# Altium schematic sheet HashPower1.SchDoc: ANT_Miner_V1.3
size A4; Date: 2013/11/20; DrawnBy: Bitmain Technology; SheetNumber: 2; SheetTotal: 9
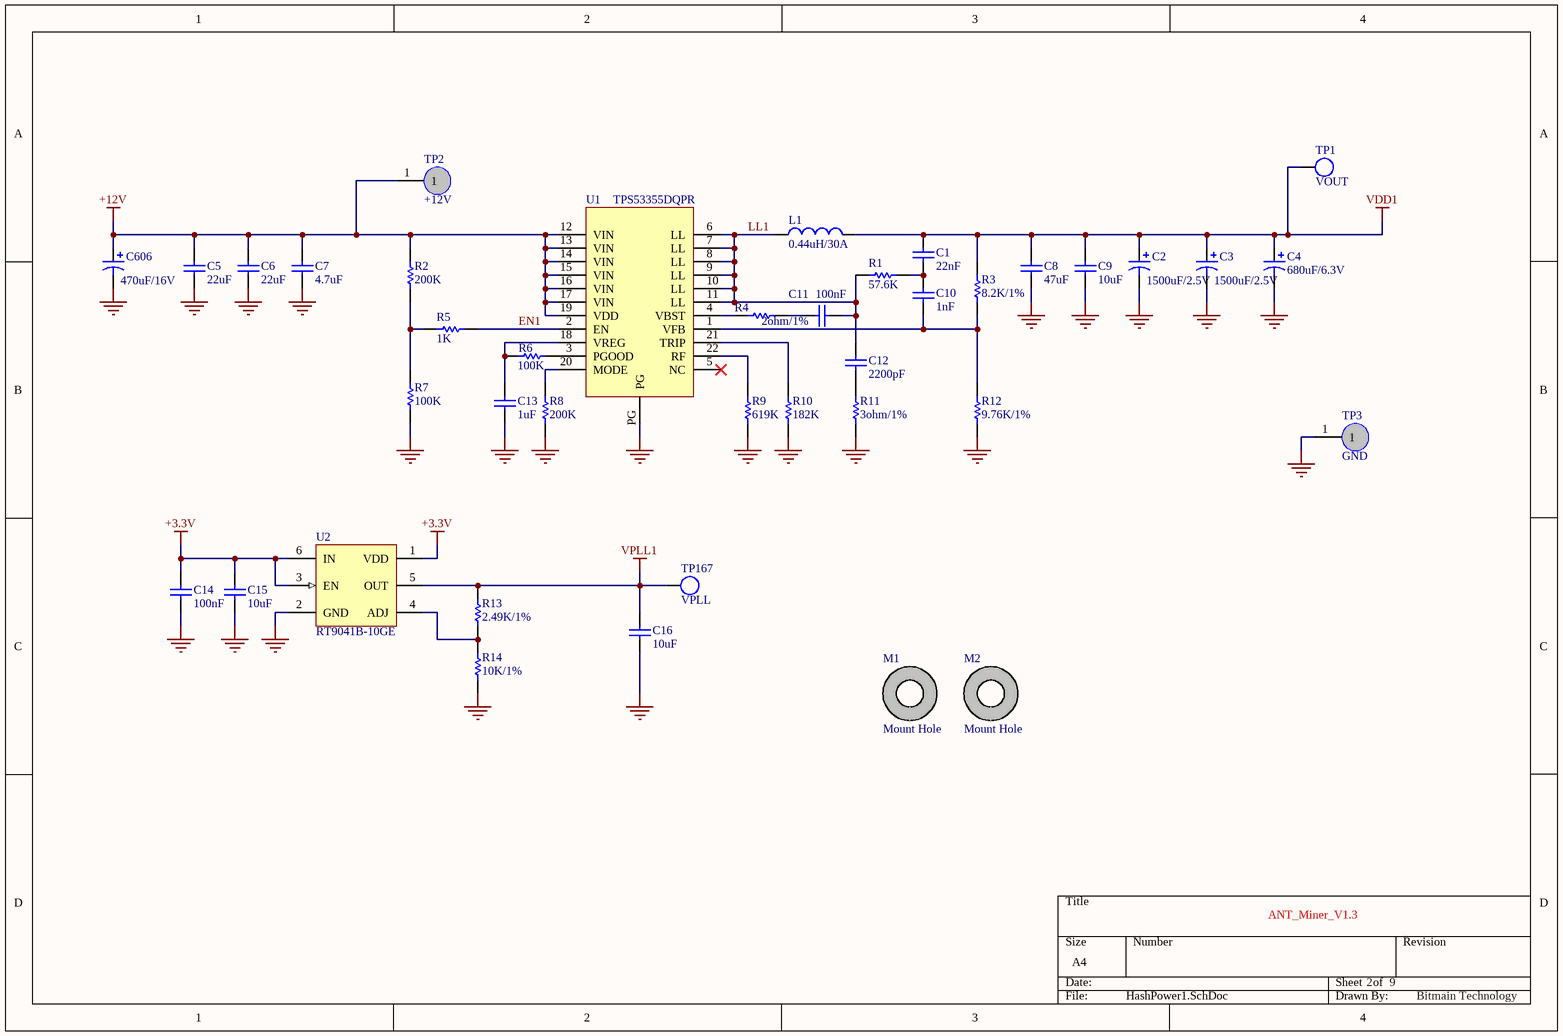
[diagram p0: HashPower1.SchDoc]

## Parts
C1  22nF  [CC0603(1608)]
C2  value 1500uF/2.5V  [F12]  (hidden comment: 1500uF/4V)
C3  value 1500uF/2.5V  [F12]  (hidden comment: 1500uF/4V)
C4  680uF/6.3V  [D]
C5  22uF  [CC1210(3225)]
C6  22uF  [CC1210(3225)]
C7  4.7uF  [CC0805(2012)]
C8  47uF  [CAPC3225L]
C9  10uF  [CAPC2012L]
C10  1nF  [CC0603(1608)]
C11  100nF  [CC0603(1608)]
C12  2200pF  [CC0603(1608)]
C13  1uF  [CC0603(1608)]
C14  100nF  [CC0603(1608)]
C15  10uF  [CC0805(2012)]
C16  10uF  [CC0805(2012)]
C606  470uF/16V  [E12]
L1  0.44uH/30A  [IHLP5050]
M1  Mount Hole  [HOLE_3.2]
M2  Mount Hole  [HOLE_3.2]
R1  57.6K  [RR0603(1608)]
R2  200K  [RR0603(1608)]
R3  8.2K/1%  [RR0603(1608)]
R4  value 2ohm/1%  [RR0603(1608)]  (hidden comment: 2)
R5  1K  [RR0603(1608)]
R6  100K  [RR0603(1608)]
R7  100K  [RR0603(1608)]
R8  200K  [RR0603(1608)]
R9  619K  [RR0603(1608)]
R10  182K  [RR0603(1608)]
R11  value 3ohm/1%  [RR0603(1608)]  (hidden comment: 3)
R12  9.76K/1%  [RR0603(1608)]
R13  2.49K/1%  [RR0603(1608)]
R14  10K/1%  [RR0603(1608)]
TP1  VOUT  [TP_SMD_1.0]
TP2  +12V  [TP]
TP3  GND  [TP]
TP167  VPLL  [TP_SMD_1.0]
U1  TPS53355DQPR  [TPS53355]
U2  RT9041B-10GE  [SOT23-6_L]

## Nets
+3.3V: C14.2 C15.2 U2.1(VDD) U2.3(EN) U2.6(IN)
+12V: C5.1 C6.1 C7.1 C606.1 R2.1 TP2.1 U1.12(VIN) U1.13(VIN) U1.14(VIN) U1.15(VIN) U1.16(VIN) U1.17(VIN) U1.19(VDD)
GND: C2.2 C3.2 C4.2 C5.2 C6.2 C7.2 C8.1 C9.1 C13.2 C14.1 C15.1 C16.1 C606.2 R7.2 R8.2 R9.2 R10.2 R11.2 R12.2 R14.1 TP3.1 U1.PG U2.2(GND)
VDD1: C1.1 C2.1 C3.1 C4.1 C8.2 C9.2 L1.2 R3.1 TP1.1
VPLL1: C16.2 R13.2 TP167.1 U2.5(OUT)
EN1: R5.2 U1.2(EN)
LL1: C11.2 C12.1 L1.1 R1.1 U1.6(LL) U1.7(LL) U1.8(LL) U1.9(LL) U1.10(LL) U1.11(LL)
NetC1_2: C1.2 C10.1 R1.2
NetC10_2: C10.2 R3.2 R12.1 U1.1(VFB)
NetC11_1: C11.1 R4.2
NetC12_2: C12.2 R11.1
NetC13_1: C13.1 R6.1 U1.18(VREG)
NetR2_2: R2.2 R5.1 R7.1
NetR4_1: R4.1 U1.4(VBST)
NetR6_2: R6.2 U1.3(PGOOD)
NetR8_1: R8.1 U1.20(MODE)
NetR9_1: R9.1 U1.22(RF)
NetR10_1: R10.1 U1.21(TRIP)
NetR13_1: R13.1 R14.2 U2.4(ADJ)

Not connected (* = marked no-connect by the designer): M1 0(PIN); M2 0(PIN); U1 5(NC)*

## Library data of the parts
C1 C5-C7 C10-C13 = Cap: Capacitor
  C1: Value: 22nF
  C5 C6: Value: 22uF
  C7: Value: 4.7uF
  C10: Value: 1nF
  C11: Value: 100nF
  C12: Value: 2200pF
  C13: Value: 1uF
C2 C3 C606 = Cap Pol2: Polarized Capacitor (SMD)
  C606: Value: 470uF/16V
C4 = Cap Pol3: Polarized Capacitor (Surface Mount); Published: 8-Jun-2000; LatestRevisionDate: 29-May-2009; LatestRevisionNote: IPC-7351 Footprint Added.; PackageReference: C0805; Publisher: Altium Limited; PackageDescription: Chip Capacitor; Value: 680uF/6.3V
C8 C9 C14-C16 = Cap Semi: Capacitor (Semiconductor SIM Model); Published: 8-Jun-2000; LatestRevisionDate: 29-May-2009; LatestRevisionNote: IPC-7351 Footprint Added.; PackageReference: C1206; Publisher: Altium Limited; PackageDescription: Chip Capacitor
  C8: Value: 47uF
  C9 C15 C16: Value: 10uF
  C14: Value: 100nF
L1 = Inductor: Code_IEC: 1005; Published: 8-Jun-2000; LatestRevisionDate: 29-May-2009; LatestRevisionNote: IPC-7351 Footprint Added.; PackageReference: 0402-A; Publisher: Altium Limited; PackageDescription: Chip Inductor; Code_JEITA: 0402; Value: 0.44uH/30A
M1 M2 = M_Hole
R1-R14 = Res1: Resistor
  R1: Value: 57.6K
  R2 R8: Value: 200K
  R3: Value: 8.2K/1%
  R5: Value: 1K
  R6 R7: Value: 100K
  R9: Value: 619K
  R10: Value: 182K
  R12: Value: 9.76K/1%
  R13: Published: 8-Jun-2000; LatestRevisionDate: 17-Jul-2002; LatestRevisionNote: Re-released for DXP Platform.; PackageReference: AXIAL-0.3; Publisher: Altium Limited; PackageDescription: Axial Device, Thru-Hole; 2 Leads; 0.3 in Pin Spacing; Value: 2.49K/1%
  R14: Published: 8-Jun-2000; LatestRevisionDate: 17-Jul-2002; LatestRevisionNote: Re-released for DXP Platform.; PackageReference: AXIAL-0.3; Publisher: Altium Limited; PackageDescription: Axial Device, Thru-Hole; 2 Leads; 0.3 in Pin Spacing; Value: 10K/1%
TP1 TP167 = TP: Test Point
  TP1: Value: VOUT
  TP167: Value: VPLL
TP2 TP3 = TP
U1 = TPS53355: TI DC-DC,Output 30A.